# Altium schematic sheet can.SchDoc
size A4
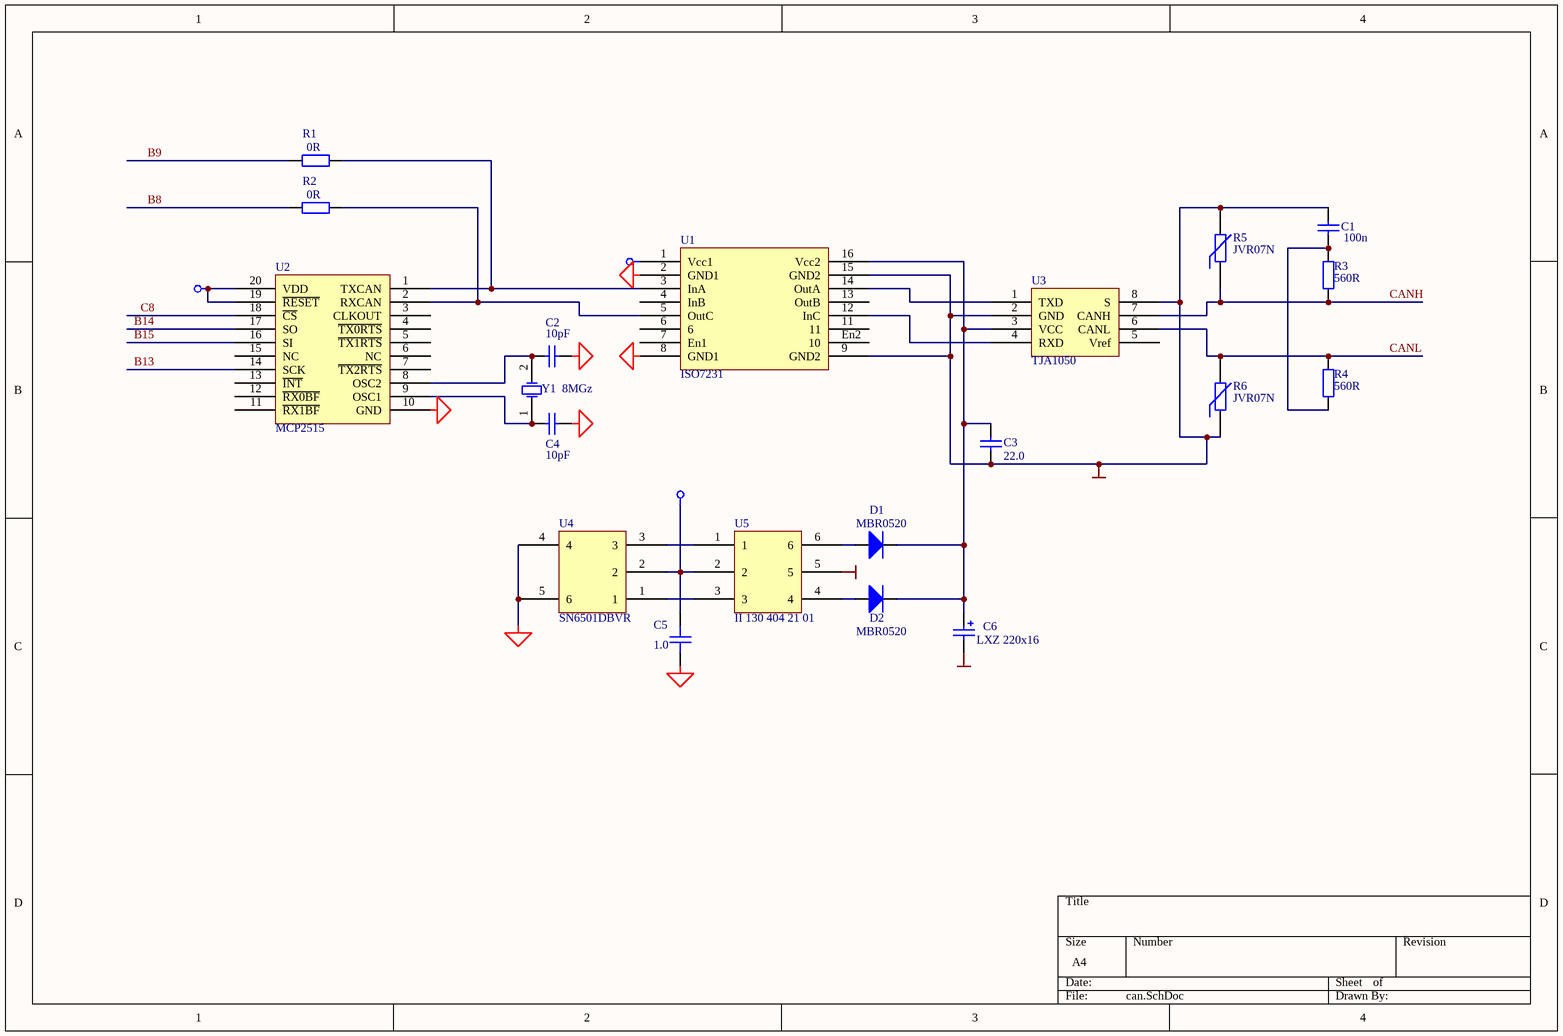
[diagram p0: can.SchDoc]

## Parts
C1  100n  [_1206]
C2  10pF  [_1206]
C3  22.0  [_1206]
C4  10pF  [_1206]
C5  1.0  [_1206]
C6  LXZ 220x16  [el3]
D1  MBR0520  [_1206d]
D2  MBR0520  [_1206d]
R1  0R  [_1206]
R2  0R  [_1206]
R3  560R  [_1206]
R4  560R  [_1206]
R5  JVR07N  [JVR07N]
R6  JVR07N  [JVR07N]
U1  ISO7231  [SO-G16/D10.4]
U2  MCP2515  [TSSO6X6-G20/D6.6]
U3  TJA1050  [SO-G8/D5]
U4  SN6501DBVR  [SO-G5/P.95]
U5  II 130 404 21 01  [II1304042101]
Y1  8MGz  [QWARZ1]

## Nets
+3v3: U2.19(~{RESET}) U2.20(VDD)
+5v: C5.2 U1.1(Vcc1) U4.2 U5.2
GND: C2.1 C4.1 C5.1 U1.2(GND1) U1.8(GND1) U2.10(GND) U4.4 U4.5(6)
GND_CAN: C1.2 C3.2 C6.2 R5.2 R6.1 U1.9(GND2) U1.15(GND2) U3.2(GND) U3.8(S) U5.5
B8: R2.1
B9: R1.1
B13: U2.14(SCK)
B14: U2.17(SO)
B15: U2.16(SI)
C8: U2.18(~{CS})
CANH: R3.1 R5.1 U3.7(CANH)
CANL: R4.2 R6.2 U3.6(CANL)
NetC1_1: C1.1 R3.2 R4.1
NetC2_2: C2.2 U2.8(OSC2) Y1.2(OSC2)
NetC3_1: C3.1 C6.1 D1.2(K) D2.2(K) U1.16(Vcc2) U3.3(VCC)
NetC4_2: C4.2 U2.9(OSC1) Y1.1(OSC1)
NetD1_1: D1.1(A) U5.6
NetD2_1: D2.1(A) U5.4
NetR1_2: R1.2 U1.3(InA) U2.1(TXCAN)
NetR2_2: R2.2 U1.5(OutC) U2.2(RXCAN)
NetU1_12: U1.12(InC) U3.4(RXD)
NetU1_14: U1.14(OutA) U3.1(TXD)
NetU4_1: U4.1 U5.3
NetU4_3: U4.3 U5.1

Not connected (* = marked no-connect by the designer): U1 4(InB) 6 7(En1) 11 13(OutB) En2(10); U2 3(CLKOUT) 4(~{TX0RTS}) 5(~{TX1RTS}) 6(NC) 7(~{TX2RTS}) 11(~{RX1BF}) 12(~{RX0BF}) 13(~{INT}) 15(NC); U3 5(Vref); U4 6(5)

## Library data of the parts
C1 C3 = Cap Semi: Capacitor (Semiconductor SIM Model); Manufacturer: Generic Components; Class I: Passive; Value: 1,0; Published: 8-Jun-2000; Revision: July-2002: Re-released for DXP Platform.; Publisher: Altium Limited; Class II: Capacitor
C2 C4 = Cap Semi: Capacitor (Semiconductor SIM Model); Manufacturer: Generic Components; Class I: Passive; Published: 8-Jun-2000; Revision: July-2002: Re-released for DXP Platform.; Publisher: Altium Limited; Class II: Capacitor; Value: 10pF
C5 = C_SM_1206: value: 1u
C6 = Cap Pol1: Polarized Capacitor (Radial); Manufacturer: Generic Components; Class I: Passive; Value: 22,0x50; Published: 8-Jun-2000; Revision: July-2002: Re-released for DXP Platform.; Publisher: Altium Limited; Class II: Capacitor
D1 D2 = Diode: Default Diode; Manufacturer: Generic Components; Class I: Discrete; Class II: Diode - Switching; Published: 8-Jun-2000; Revision: July-2002: Re-released for DXP Platform.; Publisher: Altium Limited
R1 R2 = Res2: Resistor; Manufacturer: Generic Components; Class I: Passive; Value: 2K7; Rule: Undefined; Published: 8-Jun-2000; Revision: July-2002: Re-released for DXP Platform.; Publisher: Altium Limited; Class II: Resistor
R3 R4 = Res2: Resistor; Manufacturer: Generic Components; Class I: Passive; Value: 120; Published: 8-Jun-2000; Revision: July-2002: Re-released for DXP Platform.; Publisher: Altium Limited; Class II: Resistor
R5 R6 = Res Varistor: Varistor (Voltage-Sensitive Resistor); Manufacturer: Generic Components; Class I: Discrete; Published: 24-Mar-1999; Revision: July-2002: Re-released for DXP Platform.; Publisher: Altium Limited; Class II: Voltage-Sensitive Resistor
U4 U5 = PIN6
Y1 = XTAL: Crystal Oscillator; Manufacturer: Generic Components; Published: 8-Jun-2000; Revision: July-2002: Re-released for DXP Platform.; Publisher: Altium Limited; Class I: Oscillator; Class II: Crystal Oscillator